# Altium schematic sheet RPS_ARMOR_PCB_2022_V1.1.SchDoc: RPS2022装甲板控制板
size A3; DrawnBy: SCQ; Revision: 1.0; SheetNumber: 1; SheetTotal: 1; Verision: 1.0
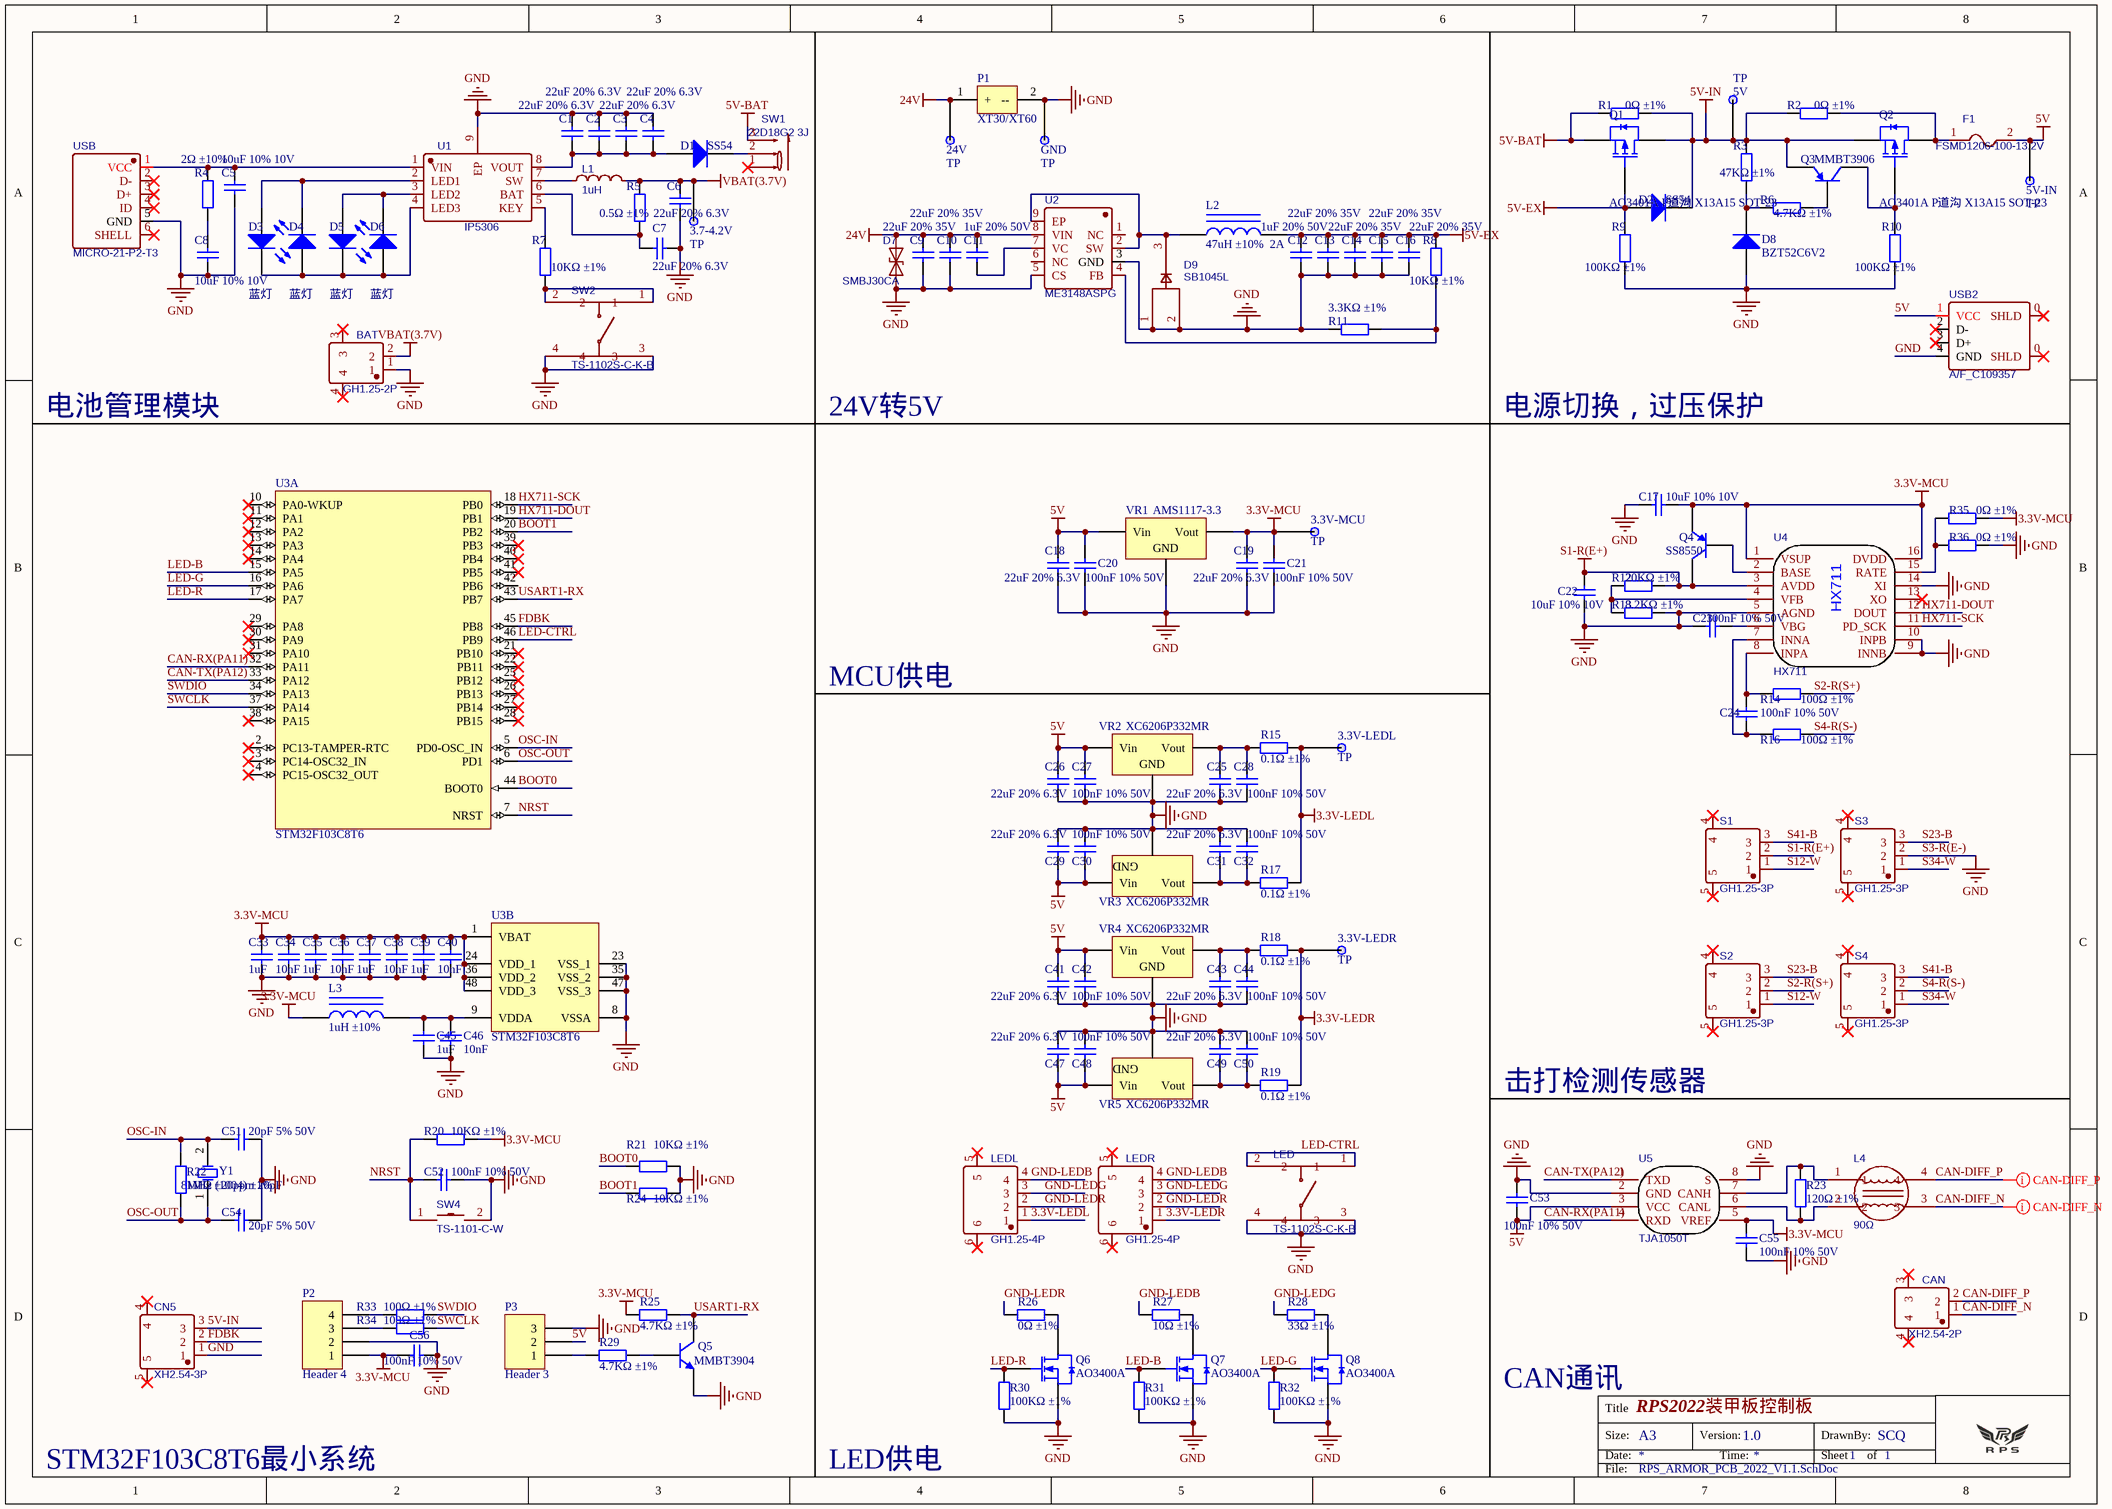
[diagram p0: RPS_ARMOR_PCB_2022_V1.1.SchDoc]

## Parts
3.3V-LEDL  TP  [TP]
3.3V-LEDR  TP  [TP]
3.3V-MCU  TP  [TP]
3.7-4.2V  TP  [TP]
5V  TP  [TP]
5V-IN  TP  [TP]
24V  TP  [TP]
BAT  GH1.25-2P  [GH1.25-WS-2P]
C1  22uF 20% 6.3V  [0603_C]
C2  22uF 20% 6.3V  [0603_C]
C3  22uF 20% 6.3V  [0603_C]
C4  22uF 20% 6.3V  [0603_C]
C5  10uF 10% 10V  [0603_C]
C6  22uF 20% 6.3V  [0603_C]
C7  22uF 20% 6.3V  [0603_C]
C8  10uF 10% 10V  [0603_C]
C9  22uF 20% 35V  [1206_C]
C10  22uF 20% 35V  [1206_C]
C11  1uF 20% 50V  [0805_C]
C12  1uF 20% 50V  [0805_C]
C13  22uF 20% 35V  [1206_C]
C14  22uF 20% 35V  [1206_C]
C15  22uF 20% 35V  [1206_C]
C16  22uF 20% 35V  [1206_C]
C17  10uF 10% 10V  [0603_C]
C18  22uF 20% 6.3V  [0603_C]
C19  22uF 20% 6.3V  [0603_C]
C20  100nF 10% 50V  [0603_C]
C21  100nF 10% 50V  [0603_C]
C22  10uF 10% 10V  [0603_C]
C23  100nF 10% 50V  [0603_C]
C24  100nF 10% 50V  [0603_C]
C25  22uF 20% 6.3V  [0603_C]
C26  22uF 20% 6.3V  [0603_C]
C27  100nF 10% 50V  [0603_C]
C28  100nF 10% 50V  [0603_C]
C29  22uF 20% 6.3V  [0603_C]
C30  100nF 10% 50V  [0603_C]
C31  22uF 20% 6.3V  [0603_C]
C32  100nF 10% 50V  [0603_C]
C33  1uF  [0603_C]
C34  10nF  [0603_C]
C35  1uF  [0603_C]
C36  10nF  [0603_C]
C37  1uF  [0603_C]
C38  10nF  [0603_C]
C39  1uF  [0603_C]
C40  10nF  [0603_C]
C41  22uF 20% 6.3V  [0603_C]
C42  100nF 10% 50V  [0603_C]
C43  22uF 20% 6.3V  [0603_C]
C44  100nF 10% 50V  [0603_C]
C45  1uF  [0603_C]
C46  10nF  [0603_C]
C47  22uF 20% 6.3V  [0603_C]
C48  100nF 10% 50V  [0603_C]
C49  22uF 20% 6.3V  [0603_C]
C50  100nF 10% 50V  [0603_C]
C51  20pF 5% 50V  [0603_C]
C52  100nF 10% 50V  [0603_C]
C53  100nF 10% 50V  [0603_C]
C54  20pF 5% 50V  [0603_C]
C55  100nF 10% 50V  [0603_C]
C56  100nF 10% 50V  [0603_C]
CAN  XH2.54-2P  [XH2.54-LS-2P]
CN5  XH2.54-3P  [XH2.54-LS-3P]
D1  SS54  [SMA(DO-214AC)_S1]
D2  SS54  [SMA(DO-214AC)_S1]
D3  蓝灯  [0603_LED_S1]
D4  蓝灯  [0603_LED_S1]
D5  蓝灯  [0603_LED_S1]
D6  蓝灯  [0603_LED_S1]
D7  SMBJ30CA  [SMB_L4.6-W3.6-LS5.3-BI]
D8  BZT52C6V2  [SOD-123]
D9  SB1045L  [TO-277A_L4.7-W6.1-LS6.6-TR]
F1  FSMD1206-100-13.2V  [F1206]
GND  TP  [TP]
L1  1uH  [IND-SMD_L7.1-W6.6]
L2  47uH ±10%  2A  [IND-SMD_L7.1-W6.6]
L3  1uH ±10%  [0805_L]
L4  90Ω  [FILTER-SMD_4P-L2.0-W1.2-BL]
LED  TS-1102S-C-K-B  [TSW SMD-6*6*8]
LEDL  GH1.25-4P  [GH1.25-WS-4P]
LEDR  GH1.25-4P  [GH1.25-WS-4P]
P1  XT30/XT60  [XT30UPB-M]
P2  Header 4  [HDR2.54-LI-4P]
P3  Header 3  [HDR2.54-LI-3P]
Q1  AO3401A P道沟 X13A15 SOT-23  [SOT-23-3L]
Q2  AO3401A P道沟 X13A15 SOT-23  [SOT-23-3L]
Q3  MMBT3906  [SOT-23(SOT-23-3)]
Q4  SS8550  [SOT-23(SOT-23-3)]
Q5  MMBT3904  [SOT-23(SOT-23-3)]
Q6  AO3400A  [SOT-23-3L]
Q7  AO3400A  [SOT-23-3L]
Q8  AO3400A  [SOT-23-3L]
R1  0Ω ±1%  [0402_R]
R2  0Ω ±1%  [0402_R]
R3  47KΩ ±1%  [0603_R]
R4  2Ω ±10%  [0603_R]
R5  0.5Ω ±1%  [1206_R]
R6  4.7KΩ ±1%  [0603_R]
R7  10KΩ ±1%  [0603_R]
R8  10KΩ ±1%  [0603_R]
R9  100KΩ ±1%  [0603_R]
R10  100KΩ ±1%  [0603_R]
R11  3.3KΩ ±1%  [0603_R]
R12  20KΩ ±1%  [0603_R]
R13  8.2KΩ ±1%  [0603_R]
R14  100Ω ±1%  [0603_R]
R15  0.1Ω ±1%  [1206_R]
R16  100Ω ±1%  [0603_R]
R17  0.1Ω ±1%  [1206_R]
R18  0.1Ω ±1%  [1206_R]
R19  0.1Ω ±1%  [1206_R]
R20  10KΩ ±1%  [0603_R]
R21  10KΩ ±1%  [0603_R]
R22  1MΩ (1004) ±1%  [0603_R]
R23  120Ω ±1%  [0603_R]
R24  10KΩ ±1%  [0603_R]
R25  4.7KΩ ±1%  [0603_R]
R26  0Ω ±1%  [0603_R]
R27  10Ω ±1%  [0603_R]
R28  33Ω ±1%  [0603_R]
R29  4.7KΩ ±1%  [0603_R]
R30  100KΩ ±1%  [0603_R]
R31  100KΩ ±1%  [0603_R]
R32  100KΩ ±1%  [0603_R]
R33  100Ω ±1%  [0603_R]
R34  100Ω ±1%  [0603_R]
R35  0Ω ±1%  [0603_R]
R36  0Ω ±1%  [0603_R]
S1  GH1.25-3P  [GH1.25-WS-3P]
S2  GH1.25-3P  [GH1.25-WS-3P]
S3  GH1.25-3P  [GH1.25-WS-3P]
S4  GH1.25-3P  [GH1.25-WS-3P]
SW1  22D18G2 3J  [SW-SMD_MST-22D18G23J]
SW2  TS-1102S-C-K-B  [TSW SMD-6*6*8]
SW4  TS-1101-C-W  [SW-SMD_L6.0-W3.3-LS8.0]
U1  IP5306  [ESOP-8_L4.9-W3.9-P1.27-LS6.0-BL-EP]
U2  ME3148ASPG  [ESOP-8_L4.9-W3.9-P1.27-LS6.0-BL-EP]
U3  STM32F103C8T6  [LQFP-48_7x7x05P]  (parts A,B of 2)
U4  HX711  [SOP16]
U5  TJA1050T  [SOIC-8_L5.0-W4.0-P1.27-LS6.0-BL]
USB  MICRO-21-P2-T3  [MICRO-USB-SMD_LI]
USB2  A/F_C109357  [USB-A-TH_USB-A-F-1]
VR1  AMS1117-3.3  [SOT-223]
VR2  XC6206P332MR  [SOT-23-3L]
VR3  XC6206P332MR  [SOT-23-3L]
VR4  XC6206P332MR  [SOT-23-3L]
VR5  XC6206P332MR  [SOT-23-3L]
Y1  8MHz ±20ppm 20pF  [SMD-5032_2P]

## Nets
3.3V-LEDL: 3.3V-LEDL.1 LEDL.1 R15.2 R17.2
3.3V-LEDR: 3.3V-LEDR.1 LEDR.1 R18.2 R19.2
3.3V-MCU: 3.3V-MCU.1 C17.2 C19.2 C21.2 C33.2 C34.2 C35.2 C36.2 C37.2 C38.2 C39.2 C40.2 C55.2 C56.1 L3.1 P2.1 Q4.2(E) R20.2 R25.1 R35.1 U3.1(VBAT) U3.24(VDD_1) U3.36(VDD_2) U3.48(VDD_3) U4.1(VSUP) U4.16(DVDD) U5.5(VREF) VR1.2(Vout)
5V: 5V-IN.1 C18.2 C20.2 C26.2 C27.2 C29.2 C30.2 C41.2 C42.2 C47.2 C48.2 C53.1 F1.2 P3.2 U5.3(VCC) USB2.1(VCC) VR1.3(Vin) VR2.3(Vin) VR3.3(Vin) VR4.3(Vin) VR5.3(Vin)
5V-BAT: Q1.2(S) R1.1 SW1.3
5V-EX: C12.2 C13.2 C14.2 C15.2 C16.2 D2.1(A) L2.2 Q1.1(G) R8.2 R9.2
5V-IN: 5V.1 CN5.3 D2.2(K) Q1.3(D) Q2.2(S) Q3.2(E) R1.2 R2.1 R3.2
24V: 24V.1 C9.2 C10.2 C11.2 D7.2 P1.1(+) U2.8(VIN)
GND: BAT.1 C1.2 C2.2 C3.2 C4.2 C5.1 C6.1 C7.1 C8.1 C9.1 C10.1 C12.1 C13.1 C14.1 C15.1 C16.1 C17.1 C18.1 C19.1 C20.1 C21.1 C22.1 C23.1 C25.1 C26.1 C27.1 C28.1 C29.1 C30.1 C31.1 C32.1 C33.1 C34.1 C35.1 C36.1 C37.1 C38.1 C39.1 C40.1 C41.1 C42.1 C43.1 C44.1 C45.1 C46.1 C47.1 C48.1 C49.1 C50.1 C51.2 C52.2 C53.2 C54.2 C55.1 C56.2 CN5.1 D7.1 D8.1(A) D9.1 D9.2 GND.1 LED.3 LED.4 P1.2(--) P2.2 P3.3 Q5.2(E) Q6.2(S) Q7.2(S) Q8.2(S) R9.1 R10.1 R11.1 R13.2 R21.2 R24.2 R30.1 R31.1 R32.1 R36.2 S3.2 SW2.3 SW2.4 SW4.2 U1.9(EP) U2.3(GND) U2.5(CS) U3.8(VSSA) U3.23(VSS_1) U3.35(VSS_2) U3.47(VSS_3) U4.5(AGND) U4.9(INNB) U4.10(INPB) U4.14(XI) U5.2(GND) U5.8(S) USB.5(GND) USB2.4(GND) VR1.1(GND) VR2.1(GND) VR3.1(GND) VR4.1(GND) VR5.1(GND)  [also labelled S3-R(E-)]
S1-R(E+): C22.2 Q4.3(C) R12.2 S1.2 U4.3(AVDD)
VBAT(3.7V): 3.7-4.2V.1 BAT.2 C6.2 L1.2 R5.2
BOOT0: R21.1 U3.44(BOOT0)
BOOT1: R24.1 U3.20(PB2)
CAN-DIFF_N: CAN.1 L4.3
CAN-DIFF_P: CAN.2 L4.4
CAN-RX(PA11): U3.32(PA11) U5.4(RXD)
CAN-TX(PA12): U3.33(PA12) U5.1(TXD)
FDBK: CN5.2 U3.45(PB8)
GND-LEDB: LEDL.4 LEDR.4 R27.2
GND-LEDG: LEDL.3 LEDR.3 R28.2
GND-LEDR: LEDL.2 LEDR.2 R26.2
HX711-DOUT: U3.19(PB1) U4.12(DOUT)
HX711-SCK: U3.18(PB0) U4.11(PD_SCK)
LED-B: Q7.1(G) R31.2 U3.15(PA5)
LED-CTRL: LED.1 LED.2 U3.46(PB9)
LED-G: Q8.1(G) R32.2 U3.16(PA6)
LED-R: Q6.1(G) R30.2 U3.17(PA7)
NRST: C52.1 R20.1 SW4.1 U3.7(NRST)
OSC-IN: C51.1 R22.2 U3.5(PD0-OSC_IN) Y1.2(OSC2)
OSC-OUT: C54.1 R22.1 U3.6(PD1) Y1.1(OSC1)
S2-R(S+): R14.2 S2.2
S4-R(S-): R16.2 S4.2
S12-W: S1.1 S2.1
S23-B: S2.3 S3.3
S34-W: S3.1 S4.1
S41-B: S1.3 S4.3
SWCLK: R34.2 U3.37(PA14)
SWDIO: R33.2 U3.34(PA13)
USART1-RX: Q5.3(C) R25.2 U3.43(PB7)
NetC1_1: C1.1 C2.1 C3.1 C4.1 D1.1(A) U1.8(VOUT)
NetC5_2: C5.2 R4.2 U1.1(VIN) USB.1(VCC)
NetC7_2: C7.2 R5.1 U1.6(BAT)
NetC8_2: C8.2 R4.1
NetC11_1: C11.1 U2.7(VC)
NetC23_2: C23.2 U4.6(VBG)
NetC24_1: C24.1 R16.1 U4.7(INNA)
NetC24_2: C24.2 R14.1 U4.8(INPA)
NetC25_2: C25.2 C28.2 R15.1 VR2.2(Vout)
NetC31_2: C31.2 C32.2 R17.1 VR3.2(Vout)
NetC43_2: C43.2 C44.2 R18.1 VR4.2(Vout)
NetC45_2: C45.2 C46.2 L3.2 U3.9(VDDA)
NetC49_2: C49.2 C50.2 R19.1 VR5.2(Vout)
NetD1_2: D1.2(K) SW1.2
NetD3_A: D3.A D4.K U1.2(LED1)
NetD3_K: D3.K D4.A D5.K D6.A U1.4(LED3)
NetD5_A: D5.A D6.K U1.3(LED2)
NetD8_2: D8.2(K) R3.1 R6.1
NetD9_3: D9.3 L2.1 U2.2(SW) U2.9(EP)
NetF1_1: F1.1 Q2.3(D) R2.2
NetL1_1: L1.1 U1.7(SW)
NetL4_1: L4.1 R23.2 U5.7(CANH)
NetL4_2: L4.2 R23.1 U5.6(CANL)
NetP2_3: P2.3 R34.1
NetP2_4: P2.4 R33.1
NetP3_1: P3.1 R29.1
NetQ2_1: Q2.1(G) Q3.3(C) R10.2
NetQ3_1: Q3.1(B) R6.2
NetQ4_1: Q4.1(B) U4.2(BASE)
NetQ5_1: Q5.1(B) R29.2
NetQ6_3: Q6.3(D) R26.1
NetQ7_3: Q7.3(D) R27.1
NetQ8_3: Q8.3(D) R28.1
NetR7_1: R7.1 SW2.1 SW2.2
NetR7_2: R7.2 U1.5(KEY)
NetR8_1: R8.1 R11.2 U2.4(FB)
NetR12_1: R12.1 R13.1 U4.4(VFB)
NetR35_2: R35.2 R36.1 U4.15(RATE)

Not connected (* = marked no-connect by the designer): BAT 3* 4*; CAN 3* 4*; CN5 4* 5*; LEDL 5* 6*; LEDR 5* 6*; S1 4* 5*; S2 4* 5*; S3 4* 5*; S4 4* 5*; SW1 1*; U2 1(NC) 6(NC); U3 2(PC13-TAMPER-RTC)* 3(PC14-OSC32_IN)* 4(PC15-OSC32_OUT)* 10(PA0-WKUP)* 11(PA1)* 12(PA2)* 13(PA3)* 14(PA4)* 21(PB10)* 22(PB11)* 25(PB12)* 26(PB13)* 27(PB14)* 28(PB15)* 29(PA8)* 30(PA9)* 31(PA10)* 38(PA15)* 39(PB3)* 40(PB4)* 41(PB5)* 42(PB6); U4 13(XO)*; USB 2(D-)* 3(D+)* 4(ID)* 6(SHELL)*; USB2 0(SHLD)* 2(D-)* 3(D+)*

## Layout directives
differential pair: CAN-DIFF_N, CAN-DIFF_P

## Notes on the sheet
- 电池管理模块
- 24V转5V
- 电源切换，过压保护
- MCU供电
- 击打检测传感器
- CAN通讯
- STM32F103C8T6最小系统
- LED供电
- Title
- Size:
- Date:
- A3
- Version:
- Time:
- DrawnBy:
- Sheet
- of
- File:

## Library data of the parts
3.3V-LEDL 3.3V-LEDR 3.3V-MCU 3.7-4.2V 5V 5V-IN 24V GND = TP: 测试点
BAT = GH1.25-2P: GH1.25端子; BOM_Manufacturer: Changjiang Connectors; BOM_Manufacturer Part: A1257WR-S-2P; Contributor: LCSC; BOM_Supplier: LCSC; BOM_Supplier Part: C225125; spicePre: C; spiceSymbolName: A1257WR-S-2P
C1-C4 C6 C7 C18 C19 C25 C26 C29 C31 C41 C43 C47 C49 = 0603 22uF (226) 20% 6.3V: C109448; ComponentLink1Description: 供应商链接; ComponentLink1URL: http://www.szlcsc.com/product/details_60514.html; Package: 0603; Supplier: LC; SuppliersPartNumber: C59461
C5 C8 = 0603 10uF (106) 10% 10V: C19702; ComponentLink1Description: 供应商链接; ComponentLink1URL: http://www.szlcsc.com/product/details_20411.html; Package: 0603; Supplier: LC; SuppliersPartNumber: C19702
C9 C10 C13-C16 = 1206 10uF (106) 10% 50V: C2835503; ComponentLink1Description: 供应商链接; ComponentLink1URL: http://www.szlcsc.com/product/details_14236.html; Package: 1206; Supplier: LC; SuppliersPartNumber: C13585
C11 C12 = 0805 1uF (105) 10% 50V: C2217678; ComponentLink1Description: 供应商链接; ComponentLink1URL: http://www.szlcsc.com/product/details_29074.html; Package: 0805; Supplier: LC; SuppliersPartNumber: C28323
C17 C22 = 0603 10uF (106) 10% 10V: 贴片电容; ComponentLink1Description: 供应商链接; ComponentLink1URL: http://www.szlcsc.com/product/details_20411.html; Package: 0603; Supplier: LC; SuppliersPartNumber: C19702
C20 C21 C23 C24 C27 C28 C30 C32 C42 C44 C48 C50 C52 C53 C55 C56 = 0603 100nF (104) 10% 50V: 贴片电容; ComponentLink1Description: 供应商链接; ComponentLink1URL: http://www.szlcsc.com/product/details_15331.html; Package: 0603; Supplier: LC; SuppliersPartNumber: C14663
C33 C35 C37 C39 C45 = 0603 1uF (105) 10% 50V: 贴片电容; ComponentLink1Description: 供应商链接; ComponentLink1URL: http://www.szlcsc.com/product/details_16531.html; Package: 0603; Supplier: LC; SuppliersPartNumber: C15849
C34 C36 C38 C40 C46 = 0603 10nF (103) 10% 50V: 贴片电容; ComponentLink1Description: 供应商链接; ComponentLink1URL: http://www.szlcsc.com/product/details_58143.html; Package: 0603; Supplier: LC; SuppliersPartNumber: C57112
C51 C54 = 0603 20pF (200) 5% 50V: 贴片电容; ComponentLink1Description: 供应商链接; ComponentLink1URL: http://www.szlcsc.com/product/details_2000.html; Package: 0603; Supplier: LC; SuppliersPartNumber: C1648
CAN = GH1.25-2P: XH2.54端子; BOM_Manufacturer: Changjiang Connectors; BOM_Manufacturer Part: A1257WR-S-2P; Contributor: LCSC; BOM_Supplier: LCSC; BOM_Supplier Part: C225125; spicePre: C; spiceSymbolName: A1257WR-S-2P
CN5 = GH1.25-3P: XH2.54端子; BOM_Manufacturer: Changjiang Connectors; BOM_Manufacturer Part: A1257WV-S-3P; Contributor: LCSC; BOM_Supplier: LCSC; BOM_Supplier Part: C225119; spicePre: C; spiceSymbolName: A1257WV-S-3P
D1 D2 = SMA(DO-214AC) SS54: C408258; ComponentLink1Description: 供应商链接; ComponentLink1URL: http://www.szlcsc.com/product/details_23178.html; Package: SMA(DO-214AC); Supplier: LC; SuppliersPartNumber: C22452
D3-D6 = 0603 蓝灯: 发光二极管; ComponentLink1Description: 供应商链接; ComponentLink1URL: http://www.szlcsc.com/product/details_73150.html; Package: 0603; Supplier: LC; SuppliersPartNumber: C72041
D7 = SMBJ30CA-C78418: C78418; BOM_Manufacturer: Brightking; BOM_Supplier: LCSC; BOM_Manufacturer Part: SMBJ30CA; BOM_Supplier Part: C78418; BOM_JLCPCB Part Class: Extended Part; spicePre: D; spiceSymbolName: SMBJ30CA-C78418
D8 = SOD-123 B5819W  SL: C699157稳压二极管; ComponentLink1Description: 供应商链接; ComponentLink1URL: http://www.szlcsc.com/product/details_9093.html; Package: SOD-123; Supplier: LC; SuppliersPartNumber: C8598
D9 = SB1045L: C113945; BOM_Manufacturer: (MDD) Jiangsu Yutai Elec; Contributor: LCSC; BOM_Supplier: LCSC; BOM_Supplier Part: C113945; BOM_Manufacturer Part: SB1045L; BOM_JLCPCB Part Class: Extended Part; spicePre: D; spiceSymbolName: SB1045L
F1 = FSMD: C883130; BOM_Manufacturer: BHFUSE; BOM_Manufacturer Part: BSMD0603L-110; Contributor: LCSC; BOM_Supplier: LCSC; BOM_Supplier Part: C914093; BOM_JLCPCB Part Class: Extended Part; spicePre: F; spiceSymbolName: BSMD0603L-110
L1 = 1uH: C87572; BOM_Manufacturer: TDK; BOM_Manufacturer Part: SPM6530T-1R0M120; nameAlias: Inductance; BOM_Supplier: LCSC; BOM_Supplier Part: C87572; BOM_JLCPCB Part Class: Extended Part; spicePre: L; spiceSymbolName: SPM6530T-1R0M120
L2 = 0805 47uH 10%: C149588; ComponentLink1Description: 供应商链接; ComponentLink1URL: http://www.szlcsc.com/product/details_14964.html; Package: 0805; Supplier: LC; SuppliersPartNumber: C14304
L3 = 0805 1uH 10%: C1042; ComponentLink1Description: 供应商链接; ComponentLink1URL: http://www.szlcsc.com/product/details_1394.html; Package: 0805; Supplier: LC; SuppliersPartNumber: C1042
L4 = 90Ω @100MHz: C307642; BOM_Manufacturer: TDK; BOM_Manufacturer Part: ACM2012H-900-2P-T00; nameAlias: Value; BOM_Supplier: LCSC; BOM_Supplier Part: C76575; BOM_JLCPCB Part Class: Extended Part; spicePre: L; spiceSymbolName: ACM2012H-900-2P-T00
LED SW2 = TS-1102S-C-K-B: C136667; pin to pad: 2>4 3>2 4>3; BOM_Manufacturer: XKB Enterprise; Contributor: LCSC; BOM_Supplier: LCSC; BOM_Supplier Part: C381049; BOM_Manufacturer Part: TS-1102S-C-K-B; BOM_JLCPCB Part Class: Extended Part; spicePre: S; spiceSymbolName: TS-1102S-C-K-B
LEDL LEDR = GH1.25-4P: GH1.25端子; BOM_Manufacturer: Changjiang Connectors; BOM_Manufacturer Part: A1257WV-S-4P; Contributor: LCSC; BOM_Supplier: LCSC; BOM_Supplier Part: C225120; spicePre: C; spiceSymbolName: A1257WV-S-4P
P1 = XT30/XT60: XT端子
P2 = Header 4: Header, 4-Pin; LatestRevisionDate: 17-Jul-2002; LatestRevisionNote: Re-released for DXP Platform.; Publisher: Altium Limited
P3 = Header 3: Header, 3-Pin; LatestRevisionDate: 17-Jul-2002; LatestRevisionNote: Re-released for DXP Platform.; Publisher: Altium Limited
Q1 Q2 = AO3401A P道沟 X13A15 SOT-23: MOS(场效应管); ComponentLink1Description: 供应商链接; ComponentLink1URL: http://www.szlcsc.com/product/details_15801.html; Package: SOT-23; Supplier: LC; SuppliersPartNumber: C15127
Q3 = SOT-23 MMBT5401 2L: C53444 三极管; ComponentLink1Description: 供应商链接; ComponentLink1URL: http://www.szlcsc.com/product/details_8818.html; Package: SOT-23; Supplier: LC; SuppliersPartNumber: C8326
Q4 = SOT-23 SS8550 Y2: C8542; ComponentLink1Description: 供应商链接; ComponentLink1URL: http://www.szlcsc.com/product/details_9037.html; Package: SOT-23; Supplier: LC; SuppliersPartNumber: C8542
Q5 = SOT-23 MMBT5551  G1: C20526三极管; ComponentLink1Description: 供应商链接; ComponentLink1URL: http://www.szlcsc.com/product/details_2502.html; Package: SOT-23; Supplier: LC; SuppliersPartNumber: C2145
Q6-Q8 = AO3400A N道沟 X0YV1T SOT-23: MOS(场效应管); ComponentLink1Description: 供应商链接; ComponentLink1URL: http://www.szlcsc.com/product/details_21629.html; Package: SOT-23; Supplier: LC; SuppliersPartNumber: C20917
R1 R2 = 0402 0Ω (0R0) 1%: 贴片电阻; ComponentLink1Description: 供应商链接; ComponentLink1URL: http://www.szlcsc.com/product/details_17853.html; Package: 0402; Supplier: LC; SuppliersPartNumber: C17168
R3 = 0603 47KΩ (4702) 1%: 贴片电阻; ComponentLink1Description: 供应商链接; ComponentLink1URL: http://www.szlcsc.com/product/details_26562.html; Package: 0603; Supplier: LC; SuppliersPartNumber: C25819
R4 = 0603 1Ω (1R00) 1%: C25225; ComponentLink1Description: 供应商链接; ComponentLink1URL: http://www.szlcsc.com/product/details_23663.html; Package: 0603; Supplier: LC; SuppliersPartNumber: C22936
R5 = 1206 0.1Ω (R100) 1%: C104947; ComponentLink1Description: 供应商链接; ComponentLink1URL: http://www.szlcsc.com/product/details_26077.html; Package: 1206; Supplier: LC; SuppliersPartNumber: C25334
R6 R25 R29 = 0603 4.7KΩ (4701) 1%: 贴片电阻; ComponentLink1Description: 供应商链接; ComponentLink1URL: http://www.szlcsc.com/product/details_23889.html; Package: 0603; Supplier: LC; SuppliersPartNumber: C23162
R7 R8 R20 R21 R24 = 0603 10KΩ (1002) 1%: 贴片电阻; ComponentLink1Description: 供应商链接; ComponentLink1URL: http://www.szlcsc.com/product/details_26547.html; Package: 0603; Supplier: LC; SuppliersPartNumber: C25804
R9 R10 R30-R32 = 0603 100KΩ (1003) 1%: 贴片电阻; ComponentLink1Description: 供应商链接; ComponentLink1URL: http://www.szlcsc.com/product/details_26546.html; Package: 0603; Supplier: LC; SuppliersPartNumber: C25803
R11 = 0603 3.3KΩ (3301) 1%: 贴片电阻; ComponentLink1Description: 供应商链接; ComponentLink1URL: http://www.szlcsc.com/product/details_23705.html; Package: 0603; Supplier: LC; SuppliersPartNumber: C22978
R12 = 0603 20KΩ (2002) 1%: C4184; ComponentLink1Description: 供应商链接; ComponentLink1URL: http://www.szlcsc.com/product/details_4591.html; Package: 0603; Supplier: LC; SuppliersPartNumber: C4184
R13 = 0603 8.2KΩ (8201) 1%: C25981; ComponentLink1Description: 供应商链接; ComponentLink1URL: http://www.szlcsc.com/product/details_26724.html; Package: 0603; Supplier: LC; SuppliersPartNumber: C25981
R14 R16 R33 R34 = 0603 100Ω (1000) 1%: 贴片电阻; ComponentLink1Description: 供应商链接; ComponentLink1URL: http://www.szlcsc.com/product/details_23502.html; Package: 0603; Supplier: LC; SuppliersPartNumber: C22775
R15 R17-R19 = 1206 0.1Ω (R100) 1%: 贴片电阻; ComponentLink1Description: 供应商链接; ComponentLink1URL: http://www.szlcsc.com/product/details_26077.html; Package: 1206; Supplier: LC; SuppliersPartNumber: C25334
R22 = 0603 1MΩ (1004) 1%: 贴片电阻; ComponentLink1Description: 供应商链接; ComponentLink1URL: http://www.szlcsc.com/product/details_23662.html; Package: 0603; Supplier: LC; SuppliersPartNumber: C22935
R23 = 0603 120Ω (1200) 1%: 贴片电阻; ComponentLink1Description: 供应商链接; ComponentLink1URL: http://www.szlcsc.com/product/details_23514.html; Package: 0603; Supplier: LC; SuppliersPartNumber: C22787
R26-R28 = 0603 1KΩ (1001) 1%: 贴片电阻; ComponentLink1Description: 供应商链接; ComponentLink1URL: http://www.szlcsc.com/product/details_21904.html; Package: 0603; Supplier: LC; SuppliersPartNumber: C21190
R35 R36 = 0603 0Ω (0R0) 1%: 贴片电阻; ComponentLink1Description: 供应商链接; ComponentLink1URL: http://www.szlcsc.com/product/details_21903.html; Package: 0603; Supplier: LC; SuppliersPartNumber: C21189
S1-S4 = GH1.25-3P: GH1.25端子; pin to pad: 4>0 5>0; BOM_Manufacturer: Changjiang Connectors; BOM_Manufacturer Part: A1257WV-S-3P; Contributor: LCSC; BOM_Supplier: LCSC; BOM_Supplier Part: C225119; spicePre: C; spiceSymbolName: A1257WV-S-3P
SW1 = MST-22D18G2 3J: C514026; BOM_Manufacturer: SHOU HAN; Contributor: LCSC; BOM_Supplier: LCSC; BOM_Supplier Part: C668586; BOM_Manufacturer Part: MST-22D18G2 3J; spicePre: S; spiceSymbolName: MST-22D18G2 3J
SW4 = TS-1101-C-W: C318938; BOM_Manufacturer: XKB Connectivity(中国星坤); Contributor: LCSC; BOM_Supplier: LCSC; BOM_Supplier Part: C318938; BOM_Manufacturer Part: TS-1101-C-W; BOM_JLCPCB Part Class: Extended Part; spicePre: S; spiceSymbolName: TS-1101-C-W
U1 = IP5306: C181692; BOM_Manufacturer: INJOINIC; Contributor: LCSC; BOM_Supplier: LCSC; BOM_Supplier Part: C181692; BOM_Manufacturer Part: IP5306; BOM_JLCPCB Part Class: Extended Part; spicePre: U; spiceSymbolName: IP5306
U2 = ME3148ASPG: C2683415; BOM_Manufacturer: MICRONE(南京微盟); Contributor: LCSC; BOM_Supplier: LCSC; BOM_Supplier Part: C2683415; BOM_Manufacturer Part: ME3148ASPG; BOM_JLCPCB Part Class: Extended Part; spicePre: U; spiceSymbolName: ME3148ASPG
U3 = STM32F103C8T6: ARM; ComponentLink1Description: 供应商链接; ComponentLink1URL: http://www.szlcsc.com/product/details_9243.html; Package: LQFP-48_7x7x05P; Supplier: LC; SuppliersPartNumber: C8734
U4 = HX711: BOM_Manufacturer: AVIA; BOM_Supplier: LCSC; BOM_Manufacturer Part: HX711; BOM_Supplier Part: C43656; BOM_JLCPCB Part Class: Extended Part; spicePre: U; spiceSymbolName: HX711
U5 = TJA1050T: C6952(C313021); BOM_Manufacturer: NXP; BOM_Manufacturer Part: TJA1050T/CM,118; BOM_Supplier: LCSC; BOM_Supplier Part: C6952; BOM_JLCPCB Part Class: Basic Part; spicePre: U; spiceSymbolName: TJA1050T/CM,118
USB = MICRO-USB-SMD_LI: C2834965 Micro-B 母座 立贴; BOM_Manufacturer: Yuandi(台湾元迪); Contributor: LCSC; BOM_Supplier: LCSC; BOM_Supplier Part: C2834965; BOM_Manufacturer Part: MICRO-21-P2-T3; BOM_JLCPCB Part Class: Extended Part; spicePre: U; spiceSymbolName: MICRO-21-P2-T3
USB2 = A/F_C109357: BOM_Manufacturer: LCSC; Contributor: 立创EDA官方封装库; BOM_Supplier: LCSC; BOM_Supplier Part: C109357; BOM_Manufacturer Part: -; BOM_JLCPCB Part Class: Extended Part; spicePre: U; spiceSymbolName: A/F_C109357
VR1 = SOT-223 AMS1117-3.3: 低压差线性稳压(LDO); ComponentLink1Description: 供应商链接; ComponentLink1URL: http://www.szlcsc.com/product/details_6652.html; Package: SOT-223; Supplier: LC; SuppliersPartNumber: C6186
VR2-VR5 = SOT-23 XC6206P332MR: 低压差线性稳压(LDO); ComponentLink1Description: 供应商链接; ComponentLink1URL: http://www.szlcsc.com/product/details_5896.html; Package: SOT-23; Supplier: LC; SuppliersPartNumber: C5446
Y1 = SMD-5032_2P 8MHz 20ppm 20pF: 贴片晶振; ComponentLink1Description: 供应商链接; ComponentLink1URL: http://www.szlcsc.com/product/details_117214.html; Package: SMD-5032_2P; Supplier: LC; SuppliersPartNumber: C115962